# Altium schematic sheet Main.SchDoc
size A2; SheetNumber: 1; SheetTotal: 1
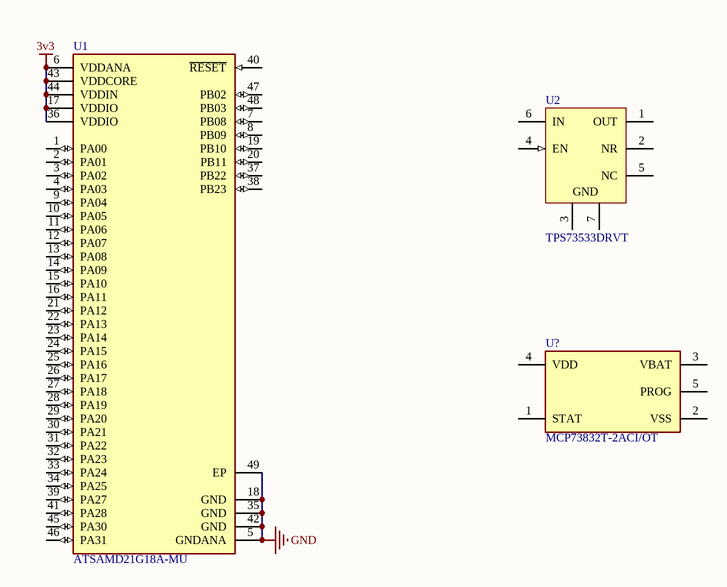
[diagram p0: Main.SchDoc]

## Parts
U1  ATSAMD21G18A-MU  [FP-C04-21493-MFG]
U2  TPS73533DRVT  [DRV0006A_V]
U?  MCP73832T-2ACI/OT  [FP-C04-091-OT-MFG]

## Nets
3v3: U1.6(VDDANA) U1.17(VDDIO) U1.36(VDDIO) U1.43(VDDCORE) U1.44(VDDIN)
GND: U1.5(GNDANA) U1.18(GND) U1.35(GND) U1.42(GND) U1.49(EP)

Not connected (* = marked no-connect by the designer): U1 1(PA00) 2(PA01) 3(PA02) 4(PA03) 7(PB08) 8(PB09) 9(PA04) 10(PA05) 11(PA06) 12(PA07) 13(PA08) 14(PA09) 15(PA10) 16(PA11) 19(PB10) 20(PB11) 21(PA12) 22(PA13) 23(PA14) 24(PA15) 25(PA16) 26(PA17) 27(PA18) 28(PA19) 29(PA20) 30(PA21) 31(PA22) 32(PA23) 33(PA24) 34(PA25) 37(PB22) 38(PB23) 39(PA27) 40(~{RESET}) 41(PA28) 45(PA30) 46(PA31) 47(PB02) 48(PB03); U2 1(OUT) 2(NR) 3(GND) 4(EN) 5(NC) 6(IN) 7(GND); U? 1(STAT) 2(VSS) 3(VBAT) 4(VDD) 5(PROG)

## Library data of the parts
U1 = CMP-06276-000052-1: IC MCU 32BIT 256KB FLASH 48QFN; Interface: I2C; Oscillator Type: Internal; Core Architecture: ARM; Peripherals: Brown-out Detect/Reset; Number of I/Os: 38; Frequency: 48MHz; Max Operating Temperature: 85°C; Memory Size: 256KB; Memory Type: FLASH; Case/Package: QFN; Packaging: Tray; Min Operating Temperature: -40°C
U2 = CMP-0395-00672-2: Single Output High PSRR LDO, 500 mA, Fixed 3.3 V Output, 2.7 to 6.5 V Input, with Low IQ, 6-pin SON (DRV), -40 to 125 degC, Green (RoHS & no Sb/Br); Manufacturer: Texas Instruments; Iout(Max)(A): 0.5; Vin(Max)(V): 6.5; Vin(Min)(V): 2.7; SubFamily: Single Channel LDO; Fixed Output Options(V): 3.3; Accuracy(%): 2; Vdo(Typ)(mV): 280; Iq(Typ)(mA): 0.04; ComponentLink3URL: http://www.ti.com/litv/pdf/mpds216d; PartNumber: TPS73533DRVT; ComponentLink2Description: Datasheet; DatasheetVersion: SBVS087J; ComponentLink3Description: Package Specification; Vout Adj(Min)(V): 3.3; Eco-Plan: Green (RoHS & no Sb/Br); ComponentLink1URL: http://www.ti.com/; Vout Adj(Max)(V): 3.3; PackageDescription: 6-Pin Plastic Small Outline No-Lead, Body 2 x 2 mm, Pitch 0.65 mm; ComponentLink2URL: http://www.ti.com/general/docs/lit/getliterature.tsp?genericPartNumber=TPS73533&fileType=pdf; PackageVersion: 4206925/E; Mounting Technology: Surface Mount; PackageReference: DRV0006A; ComponentLink1Description: Manufacturer URL
U? = CMP-0133-00138-2: IC LI-ION/LI-POLY CTRLR SOT23-5; Output Current: 10mA; Output Voltage: 4.2V; Max Output Current: 500mA; Max Power Dissipation: 1.54W; Min Output Voltage: 4.168V; Number of Channels: 1; Max Supply Voltage: 6V; Min Supply Voltage: 3.75V; Max Output Voltage: 4.5V; Case/Package: SOT-23; Lead Free: Lead Free; Termination: SMD/SMT; Min Operating Temperature: -40°C; Max Operating Temperature: 85°C; Height: 1.3mm; Length: 3.1mm; Mount: Surface Mount; Package Quantity: 3000; Number of Pins: 5; Packaging: Tape and Reel; REACH SVHC: No SVHC; Contact Plating: Tin; Width: 1.8mm; Number of Cells: 1; Number of Outputs: 1; Power Dissipation: 1.54W; Max Charge Current: 500mA; Max Input Voltage: 6V; Radiation Hardening: No